# Altium project DuAn_HighVoltage_Switch_V3.PrjPcb
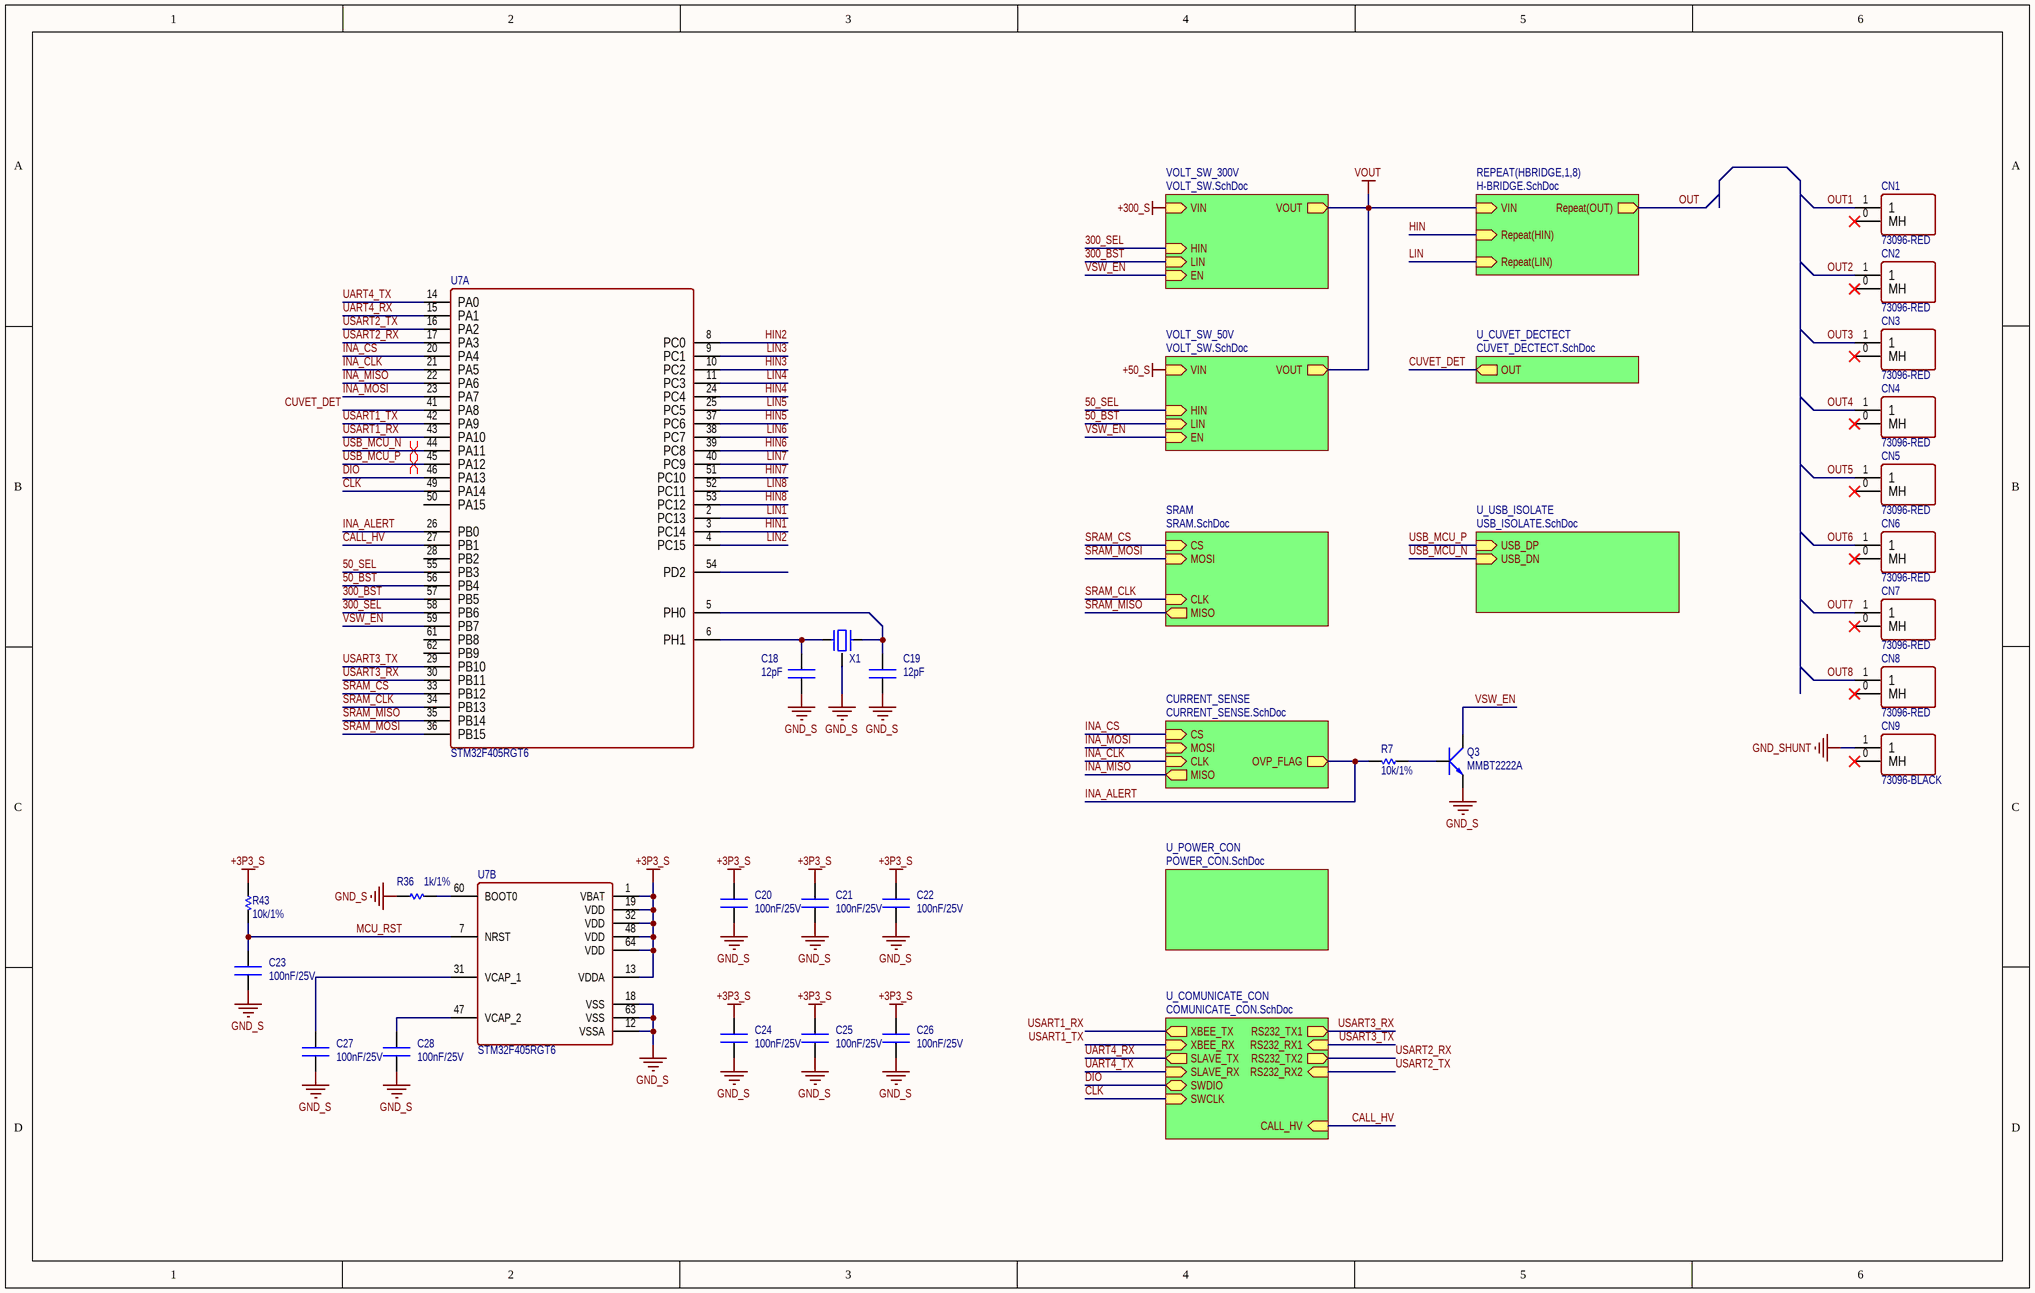
[diagram p0: MAIN.SchDoc]
10 sheets, 274 parts. Net scope: hierarchical (ports join the sheet entries above them; power ports are global).
Board file: PCB2.PcbDoc
Sheets:
  MAIN.SchDoc
    HBRIDGE1 = H-BRIDGE.SchDoc
    HBRIDGE2 = H-BRIDGE.SchDoc
    HBRIDGE3 = H-BRIDGE.SchDoc
    HBRIDGE4 = H-BRIDGE.SchDoc
    HBRIDGE5 = H-BRIDGE.SchDoc
    HBRIDGE6 = H-BRIDGE.SchDoc
    HBRIDGE7 = H-BRIDGE.SchDoc
    HBRIDGE8 = H-BRIDGE.SchDoc
    VOLT_SW_300V = VOLT_SW.SchDoc
    VOLT_SW_50V = VOLT_SW.SchDoc
    SRAM = SRAM.SchDoc
    CURRENT_SENSE = CURRENT_SENSE.SchDoc
    U_POWER_CON = POWER_CON.SchDoc
    U_COMUNICATE_CON = COMUNICATE_CON.SchDoc
    U_CUVET_DECTECT = CUVET_DECTECT.SchDoc
    U_USB_ISOLATE = USB_ISOLATE.SchDoc
  CUVET_DECTECT_POWER.SchDoc

## Sheet MAIN.SchDoc
size B; SheetNumber: 1; SheetTotal: 10

### Parts
C18  12pF  [CN-SMD-0603]
C19  12pF  [CN-SMD-0603]
C20  100nF/25V  [CN-SMD-0603]
C21  100nF/25V  [CN-SMD-0603]
C22  100nF/25V  [CN-SMD-0603]
C23  100nF/25V  [CN-SMD-0603]
C24  100nF/25V  [CN-SMD-0603]
C25  100nF/25V  [CN-SMD-0603]
C26  100nF/25V  [CN-SMD-0603]
C27  100nF/25V  [CN-SMD-0603]
C28  100nF/25V  [CN-SMD-0603]
CN1  73096-RED  [73096-2-RED]
CN2  73096-RED  [73096-2-RED]
CN3  73096-RED  [73096-2-RED]
CN4  73096-RED  [73096-2-RED]
CN5  73096-RED  [73096-2-RED]
CN6  73096-RED  [73096-2-RED]
CN7  73096-RED  [73096-2-RED]
CN8  73096-RED  [73096-2-RED]
CN9  73096-BLACK  [73096-0-BLACK]
Q3  MMBT2222A  [SOT23-132]
R7  10k/1%  [RES-SMD-0603]
R36  1k/1%  [RES-SMD-0603]
R43  10k/1%  [RES-SMD-0603]
U7  STM32F405RGT6  [LQFP64]  (parts A,B of 2)
X1  ECS-80-8-33Q-ADS  [XT4-16.000MHz-4_V]  (value not drawn)

### Sub-sheets
CURRENT_SENSE = CURRENT_SENSE.SchDoc: CS (in), MOSI (in), MISO (out), CLK (in), OVP_FLAG (out)
REPEAT(HBRIDGE,1,8) = H-BRIDGE.SchDoc: Repeat(OUT) (out), Repeat(HIN) (in), Repeat(LIN) (in), VIN (in)
SRAM = SRAM.SchDoc: CS (in), MOSI (in), MISO (out), CLK (in)
U_COMUNICATE_CON = COMUNICATE_CON.SchDoc: XBEE_TX (out), XBEE_RX (in), RS232_TX1 (out), RS232_RX1 (in), SLAVE_TX (out), SWDIO (bidir), SWCLK (in), RS232_TX2 (out), RS232_RX2 (in), SLAVE_RX (in), CALL_HV (in)
U_CUVET_DECTECT = CUVET_DECTECT.SchDoc: OUT (out)
U_POWER_CON = POWER_CON.SchDoc: no entries
U_USB_ISOLATE = USB_ISOLATE.SchDoc: USB_DP (in), USB_DN (in)
VOLT_SW_50V = VOLT_SW.SchDoc: HIN (in), LIN (in), EN (in), VOUT (out), VIN (in)
VOLT_SW_300V = VOLT_SW.SchDoc: HIN (in), LIN (in), EN (in), VOUT (out), VIN (in)

### Nets
+3P3_S: C20.1 C21.1 C22.1 C24.1 C25.1 C26.1 R43.2 U7.1(VBAT) U7.13(VDDA) U7.19(VDD) U7.32(VDD) U7.48(VDD) U7.64(VDD)
GND_S: C18.1 C19.1 C20.2 C21.2 C22.2 C23.2 C24.2 C25.2 C26.2 C27.2 C28.2 Q3.2(E) R36.2 U7.12(VSSA) U7.18(VSS) U7.63(VSS) X1.2,4(GND)
GND_SHUNT: CN9.1
VOUT: sheet REPEAT(HBRIDGE,1,8)/VIN, sheet VOLT_SW_300V/VOUT, sheet VOLT_SW_50V/VOUT
50_BST: U7.56(PB4) ; sheet VOLT_SW_50V/LIN
50_SEL: U7.55(PB3) ; sheet VOLT_SW_50V/HIN
300_BST: U7.57(PB5) ; sheet VOLT_SW_300V/LIN
300_SEL: U7.58(PB6) ; sheet VOLT_SW_300V/HIN
CALL_HV: U7.27(PB1) ; sheet U_COMUNICATE_CON/CALL_HV
CLK: U7.49(PA14) ; sheet U_COMUNICATE_CON/SWCLK
CUVET_DET: U7.41(PA8) ; sheet U_CUVET_DECTECT/OUT
DIO: U7.46(PA13) ; sheet U_COMUNICATE_CON/SWDIO
HIN: sheet REPEAT(HBRIDGE,1,8)/Repeat(HIN)
HIN1: U7.3(PC14)
HIN2: U7.8(PC0)
HIN3: U7.10(PC2)
HIN4: U7.24(PC4)
HIN5: U7.37(PC6)
HIN6: U7.39(PC8)
HIN7: U7.51(PC10)
HIN8: U7.53(PC12)
INA_ALERT: R7.1 U7.26(PB0) ; sheet CURRENT_SENSE/OVP_FLAG
INA_CLK: U7.21(PA5) ; sheet CURRENT_SENSE/CLK
INA_CS: U7.20(PA4) ; sheet CURRENT_SENSE/CS
INA_MISO: U7.22(PA6) ; sheet CURRENT_SENSE/MISO
INA_MOSI: U7.23(PA7) ; sheet CURRENT_SENSE/MOSI
LIN: sheet REPEAT(HBRIDGE,1,8)/Repeat(LIN)
LIN1: U7.2(PC13)
LIN2: U7.4(PC15)
LIN3: U7.9(PC1)
LIN4: U7.11(PC3)
LIN5: U7.25(PC5)
LIN6: U7.38(PC7)
LIN7: U7.40(PC9)
LIN8: U7.52(PC11)
MCU_RST: C23.1 R43.1 U7.7(NRST)
OUT: sheet REPEAT(HBRIDGE,1,8)/Repeat(OUT)
OUT1: CN1.1
OUT2: CN2.1
OUT3: CN3.1
OUT4: CN4.1
OUT5: CN5.1
OUT6: CN6.1
OUT7: CN7.1
OUT8: CN8.1
SRAM_CLK: U7.34(PB13) ; sheet SRAM/CLK
SRAM_CS: U7.33(PB12) ; sheet SRAM/CS
SRAM_MISO: U7.35(PB14) ; sheet SRAM/MISO
SRAM_MOSI: U7.36(PB15) ; sheet SRAM/MOSI
UART4_RX: U7.15(PA1) ; sheet U_COMUNICATE_CON/SLAVE_TX
UART4_TX: U7.14(PA0) ; sheet U_COMUNICATE_CON/SLAVE_RX
USART1_RX: U7.43(PA10) ; sheet U_COMUNICATE_CON/XBEE_TX
USART1_TX: U7.42(PA9) ; sheet U_COMUNICATE_CON/XBEE_RX
USART2_RX: U7.17(PA3) ; sheet U_COMUNICATE_CON/RS232_TX2
USART2_TX: U7.16(PA2) ; sheet U_COMUNICATE_CON/RS232_RX2
USART3_RX: U7.30(PB11) ; sheet U_COMUNICATE_CON/RS232_TX1
USART3_TX: U7.29(PB10) ; sheet U_COMUNICATE_CON/RS232_RX1
USB_MCU_N: U7.44(PA11) ; sheet U_USB_ISOLATE/USB_DN
USB_MCU_P: U7.45(PA12) ; sheet U_USB_ISOLATE/USB_DP
VSW_EN: Q3.3(C) U7.59(PB7) ; sheet VOLT_SW_300V/EN, sheet VOLT_SW_50V/EN
NetC18_2: C18.2 U7.6(PH1) X1.3
NetC19_2: C19.2 U7.5(PH0) X1.1
NetC27_1: C27.1 U7.31(VCAP_1)
NetC28_1: C28.1 U7.47(VCAP_2)
NetQ3_1: Q3.1(B) R7.2
NetR36_1: R36.1 U7.60(BOOT0)

Not connected (* = marked no-connect by the designer): CN1 0(MH)*; CN2 0(MH)*; CN3 0(MH)*; CN4 0(MH)*; CN5 0(MH)*; CN6 0(MH)*; CN7 0(MH)*; CN8 0(MH)*; CN9 0(MH)*; U7 28(PB2) 50(PA15) 54(PD2) 61(PB8) 62(PB9)

### Layout directives
differential pair; differential pair class USB: USB_MCU_N, USB_MCU_P

### Library data of the parts
C18 C19 = CN: CL10C120JB81PNC; PN: CL10C120JB81PNC
C20-C28 = CN: CL10B104KA8NNNC; PN: CL10B104KA8NNNC
CN1-CN8 = BANANA: Banana connector; PN: 73096-2-RED
CN9 = BANANA: Banana connector; PN: 73096-2-BLACK
Q3 = 2SC1815: PN: MMBT2222A
R7 R43 = Res-SMD: ERJ-3EKF1002V; Manufacturer: Generic Components; Class: Passive; PN: ERJ-3EKF1002V; Publisher: Altium Hobart Technology Centre
R36 = Res-SMD: ERJ-3EKF1001V; Manufacturer: Generic Components; Class: Passive; PN: ERJ-3EKF1001V; Publisher: Altium Hobart Technology Centre
U7 = STM32F405RGT6: High-performance foundation line, ARM Cortex-M4 core with DSP and FPU, 1 Mbyte Flash, 168 MHz CPU, ART Accelerator; PN: STM32F405RGT6
X1 = XT4: PN: ECS-80-8-33Q-ADS

## Sheet H-BRIDGE.SchDoc
size A; SheetNumber: 2; SheetTotal: 9
Used 8 times, as channels HBRIDGE1, HBRIDGE2, HBRIDGE3, HBRIDGE4, HBRIDGE5, HBRIDGE6, HBRIDGE7, HBRIDGE8. Parts and nets are listed once, with the designators drawn on the sheet.
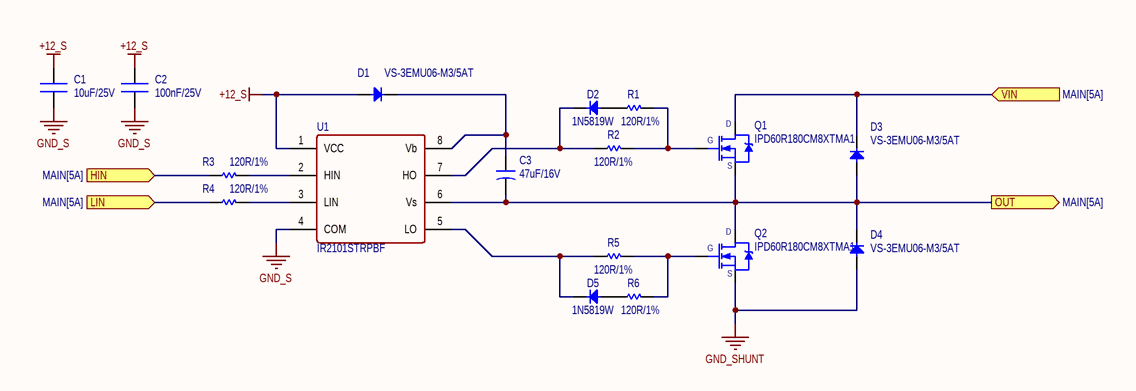
[diagram p1: H-BRIDGE.SchDoc]

### Parts
C1  10uF/25V  [CN-SMD-0603]
C2  100nF/25V  [CN-SMD-0603]
C3  47uF/16V  [Tantalum 1210]
D1  VS-3EMU06-M3/5AT  [DIO-SMD-A]
D2  1N5819W  [DIO-SMD-123]
D3  VS-3EMU06-M3/5AT  [DIO-SMD-A]
D4  VS-3EMU06-M3/5AT  [DIO-SMD-A]
D5  1N5819W  [DIO-SMD-123]
Q1  IPD60R180CM8XTMA1  [TO252-123]
Q2  IPD60R180CM8XTMA1  [TO252-123]
R1  120R/1%  [RES-SMD-0603]
R2  120R/1%  [RES-SMD-0603]
R3  120R/1%  [RES-SMD-0603]
R4  120R/1%  [RES-SMD-0603]
R5  120R/1%  [RES-SMD-0603]
R6  120R/1%  [RES-SMD-0603]
U1  IR2101STRPBF  [SO8]

### Ports
HIN (in, see MAIN[5A]), LIN (in, see MAIN[5A]), OUT (out, see MAIN[5A]), VIN (in, see MAIN[5A])

### Nets
+12_S: C1.2 C2.2 D1.1(A) U1.1(VCC)
GND_S: C1.1 C2.1 U1.4(COM)
GND_SHUNT: D4.1(A) Q2.3(S)
HIN: R3.1 ; port HIN
LIN: R4.1 ; port LIN
OUT: C3.2 D3.1(A) D4.2(K) Q1.3(S) Q2.2(D) U1.6(Vs) ; port OUT
VIN: D3.2(K) Q1.2(D) ; port VIN
NetC3_1: C3.1 D1.2(K) U1.8(Vb)
NetD2_1: D2.1(A) R1.1
NetD2_2: D2.2(K) R2.1 U1.7(HO)
NetD5_1: D5.1(A) R6.1
NetD5_2: D5.2(K) R5.1 U1.5(LO)
NetQ1_1: Q1.1(G) R1.2 R2.2
NetQ2_1: Q2.1(G) R5.2 R6.2
NetR3_2: R3.2 U1.2(HIN)
NetR4_2: R4.2 U1.3(LIN)

### Channels
HBRIDGE1: designators end in A; ports HIN=HIN1 LIN=LIN1 OUT=OUT1 VIN=VOUT
HBRIDGE2: designators end in B; ports HIN=HIN2 LIN=LIN2 OUT=OUT2 VIN=VOUT
HBRIDGE3: designators end in C; ports HIN=HIN3 LIN=LIN3 OUT=OUT3 VIN=VOUT
HBRIDGE4: designators end in D; ports HIN=HIN4 LIN=LIN4 OUT=OUT4 VIN=VOUT
HBRIDGE5: designators end in E; ports HIN=HIN5 LIN=LIN5 OUT=OUT5 VIN=VOUT
HBRIDGE6: designators end in F; ports HIN=HIN6 LIN=LIN6 OUT=OUT6 VIN=VOUT
HBRIDGE7: designators end in G; ports HIN=HIN7 LIN=LIN7 OUT=OUT7 VIN=VOUT
HBRIDGE8: designators end in H; ports HIN=HIN8 LIN=LIN8 OUT=OUT8 VIN=VOUT

### Library data of the parts
C1 = CN: 0603W106M250XD; PN: 0603W106M250XD
C2 = CN: CL10B104KA8NNNC; PN: CL10B104KA8NNNC
C3 = CN-SMD: TCNT476M016R0200; PN: TCNT476M016R0200; LatestRevisionDate: 17-Jul-2002; LatestRevisionNote: Re-released for DXP Platform.; PackageReference: POLAR0.8; Publisher: Altium Limited
D1-D5 = Diode SMD: Code - JEDEC: DO-214-AB; Published: 8-Jun-2000; Revision: July-2002: Re-released for DXP Platform.; Publisher: Altium Limited
  D1 D3 D4: PN: VS-3EMU06-M3/5AT
  D2 D5: PN: 1N5819W
Q1 Q2 = FDD8870: PN: IPD60R180CM8XTMA1
R1-R6 = Res-SMD: ERJ-3EKF1200V; Manufacturer: Generic Components; Class: Passive; PN: ERJ-3EKF1200V; Publisher: Altium Hobart Technology Centre
U1 = IR2101S: PN: IR2101STRPBF

## Sheet VOLT_SW.SchDoc
size B; SheetNumber: 5; SheetTotal: 9
Used 2 times, as channels VOLT_SW_300V, VOLT_SW_50V. Parts and nets are listed once, with the designators drawn on the sheet.
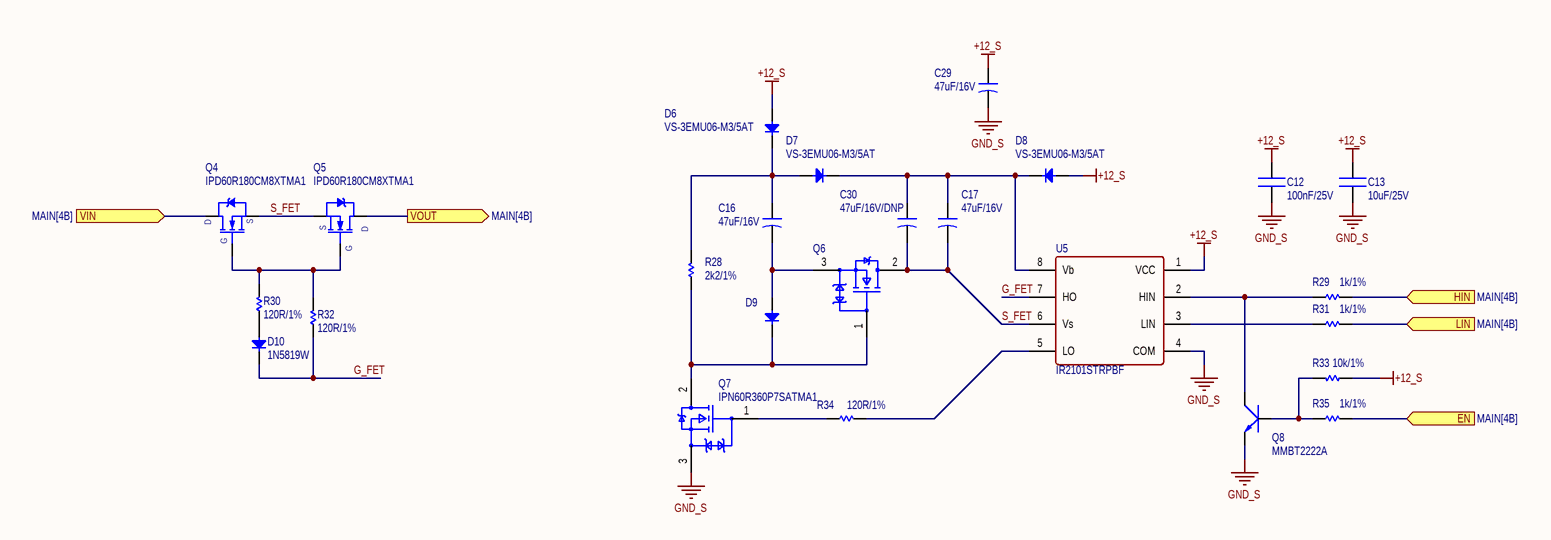
[diagram p2: VOLT_SW.SchDoc]

### Parts
C12  100nF/25V  [CN-SMD-0603]
C13  10uF/25V  [CN-SMD-0603]
C16  47uF/16V  [Tantalum 1210]
C17  47uF/16V  [Tantalum 1210]
C29  47uF/16V  [Tantalum 1210]
C30  47uF/16V/DNP  [Tantalum 1210]
D6  VS-3EMU06-M3/5AT  [DIO-SMD-A]
D7  VS-3EMU06-M3/5AT  [DIO-SMD-A]
D8  VS-3EMU06-M3/5AT  [DIO-SMD-A]
D9  VS-3EMU06-M3/5AT  [DIO-SMD-A]  (value not drawn)
D10  1N5819W  [DIO-SMD-123]
Q4  IPD60R180CM8XTMA1  [TO252-123]
Q5  IPD60R180CM8XTMA1  [TO252-123]
Q6  IPN60R360P7SATMA1  [SOT223-3]  (value not drawn)
Q7  IPN60R360P7SATMA1  [SOT223-3]
Q8  MMBT2222A  [SOT23-132]
R28  2k2/1%  [RES-SMD-0603]
R29  1k/1%  [RES-SMD-0603]
R30  120R/1%  [RES-SMD-0603]
R31  1k/1%  [RES-SMD-0603]
R32  120R/1%  [RES-SMD-0603]
R33  10k/1%  [RES-SMD-0603]
R34  120R/1%  [RES-SMD-0603]
R35  1k/1%  [RES-SMD-0603]
U5  IR2101STRPBF  [SO8]

### Ports
EN (in, see MAIN[4B]), HIN (in, see MAIN[4B]), LIN (in, see MAIN[4B]), VIN (in, see MAIN[4B]), VOUT (out, see MAIN[4B])

### Nets
+12_S: C12.2 C13.2 C29.1 D6.1(A) D8.1(A) R33.1 U5.1(VCC)
GND_S: C12.1 C13.1 C29.2 Q7.3(Source) Q8.2(E) U5.4(COM)
EN: R35.1 ; port EN
G_FET: D10.2(K) R32.1 U5.7(HO)
HIN: R29.1 ; port HIN
LIN: R31.1 ; port LIN
S_FET: C17.2 C30.2 Q4.3(S) Q5.3(S) Q6.2(Drain) U5.6(Vs)
VIN: Q4.2(D) ; port VIN
VOUT: Q5.2(D) ; port VOUT
NetC16_1: C16.1 D6.2(K) D7.1(A) R28.2
NetC16_2: C16.2 D9.1(A) Q6.3(Source)
NetC17_1: C17.1 C30.1 D7.2(K) D8.2(K) U5.8(Vb)
NetD9_2: D9.2(K) Q6.1(Gate) Q7.2(Drain) R28.1
NetD10_1: D10.1(A) R30.1
NetQ4_1: Q4.1(G) Q5.1(G) R30.2 R32.2
NetQ7_1: Q7.1(Gate) R34.1
NetQ8_1: Q8.1(B) R33.2 R35.2
NetQ8_3: Q8.3(C) R29.2 U5.2(HIN)
NetR31_2: R31.2 U5.3(LIN)
NetR34_2: R34.2 U5.5(LO)

### Channels
VOLT_SW_300V: designators end in A; ports EN=VSW_EN HIN=300_SEL LIN=300_BST VIN=+300_S VOUT=VOUT
VOLT_SW_50V: designators end in B; ports EN=VSW_EN HIN=50_SEL LIN=50_BST VIN=+50_S VOUT=VOUT

### Library data of the parts
C12 = CN: CL10B104KA8NNNC; PN: CL10B104KA8NNNC
C13 = CN: 0603W106M250XD; PN: 0603W106M250XD
C16 C17 C29 = CN-SMD: TCNT476M016R0200; PN: TCNT476M016R0200; LatestRevisionDate: 17-Jul-2002; LatestRevisionNote: Re-released for DXP Platform.; PackageReference: POLAR0.8; Publisher: Altium Limited
C30 = CN-SMD: TCNT476M016R0200/DNP; PN: TCNT476M016R0200/DNP; LatestRevisionDate: 17-Jul-2002; LatestRevisionNote: Re-released for DXP Platform.; PackageReference: POLAR0.8; Publisher: Altium Limited
D6-D10 = Diode SMD: Code - JEDEC: DO-214-AB; Published: 8-Jun-2000; Revision: July-2002: Re-released for DXP Platform.; Publisher: Altium Limited
  D6-D9: PN: VS-3EMU06-M3/5AT
  D10: PN: 1N5819W
Q4 Q5 = FDD8870: PN: IPD60R180CM8XTMA1
Q6 Q7 = IPN60R360P7SATMA1: Manufacturer: Infineon; Max Junction Temp: +150°C; Number Of Channels: 1; Pulse Drain Current: 26A; Drain To Source Breakdown Voltage: 600V; Gate To Source Voltage: 20V; Depletion Mode: False; Typ Forward Diode Voltage: 0.9V; Gate Charge At Vgs: 13nC @ 10V; Turn Off Delay Time: 42ns; Input Capacitace At Vds: 555pF @ 400V; Power Dissipation: 7W; Drain To Source Resistance: 0.3Ω; Threshold Vgs Max: 4V; Drain To Source Voltage: 650V; Reverse Recovery Time: 145ns; Continuous Drain Current: 9A; Reverse Recovery Charge: 740nC; Rthja Max: 35°C/W; Turn On Delay Time: 8ns; Threshold Vgs Min: 3V; Device Class L3: MOSFETs; Device Class L2: Transistors; Manufacturer Part Number: IPN60R360P7SATMA1; PN: IPN60R360P7SATMA1; Footprint Url: https://www.infineon.com/cms/en/product/packages/PG-SOT223/PG-SOT223-3-1/; Category: Trans; Device Class L1: Discrete Semiconductors; Lead Free: Yes; ComponentLink2URL: https://www.infineon.com/dgdl/Infineon-IPN60R360P7S-DS-v02_00-EN.pdf?fileId=5546d4625cc9456a015cf3d550b26150; Temperature: -40°C to +150°C; Temperature Range High: +150°C; Temperature Range Low: -40°C; Automotive: No; ComponentLink2Description: Datasheet; Digikey Description: MOSFET N-CHANNEL 600V 9A SOT223; RoHS: TRUE; Package: PG-SOT223-3; Height: 1.8mm; Octopart: https://octopart.com/ipn60r360p7satma1-infineon-84309560
Q8 = 2SC1815: PN: MMBT2222A
R28 = Res-SMD: ERJ-3EKF2201V; Manufacturer: Generic Components; Class: Passive; PN: ERJ-3EKF2201V; Publisher: Altium Hobart Technology Centre
R29 R31 R35 = Res-SMD: as R36 on sheet MAIN; PN: ERJ-3EKF1001V; Publisher: Altium Hobart Technology Centre
R30 R32 R34 = Res-SMD: as R1 on sheet H-BRIDGE; PN: ERJ-3EKF1200V; Publisher: Altium Hobart Technology Centre
R33 = Res-SMD: as R7 on sheet MAIN; PN: ERJ-3EKF1002V; Publisher: Altium Hobart Technology Centre
U5 = IR2101S

## Sheet SRAM.SchDoc
size A; SheetNumber: 4; SheetTotal: 10
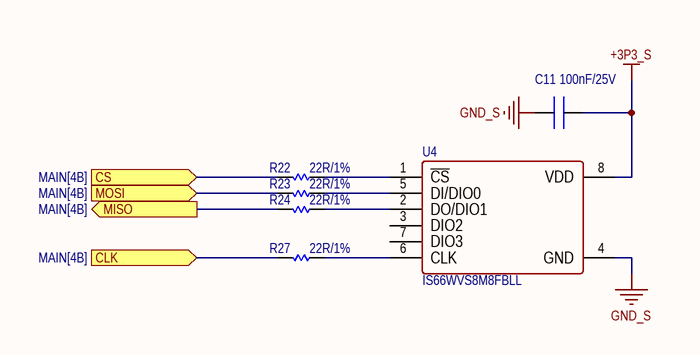
[diagram p3: SRAM.SchDoc]

### Parts
C11  100nF/25V  [CN-SMD-0603]
R22  22R/1%  [RES-SMD-0603]
R23  22R/1%  [RES-SMD-0603]
R24  22R/1%  [RES-SMD-0603]
R27  22R/1%  [RES-SMD-0603]
U4  IS66WVS8M8FBLL  [SO8]

### Ports
CLK (in, see MAIN[4B]), CS (in, see MAIN[4B]), MISO (out, see MAIN[4B]), MOSI (in, see MAIN[4B])

### Nets
+3P3_S: C11.2 U4.8(VDD)
GND_S: C11.1 U4.4(GND)
SRAM_CLK: R27.2 ; port CLK
SRAM_CS: R22.2 ; port CS
SRAM_MISO: R24.2 ; port MISO
SRAM_MOSI: R23.2 ; port MOSI
NetR22_1: R22.1 U4.1(~{CS})
NetR23_1: R23.1 U4.5(DI/DIO0)
NetR24_1: R24.1 U4.2(DO/DIO1)
NetR27_1: R27.1 U4.6(CLK)

Not connected (* = marked no-connect by the designer): U4 3(DIO2) 7(DIO3)

### Library data of the parts
C11 = CN: CL10B104KA8NNNC; PN: CL10B104KA8NNNC
R22-R24 R27 = Res-SMD: ERJ-3EKF22R0V; Manufacturer: Generic Components; Class: Passive; PN: ERJ-3EKF22R0V; Publisher: Altium Hobart Technology Centre
U4 = IS66WVS8M8FBLL: 64Mb SerialRAM 1.8V/3.0V, 104MHZ, SPI & QPI PROTOCOL; PN: IS66WVS8M8FBLL

## Sheet CURRENT_SENSE.SchDoc
size A; SheetNumber: 3; SheetTotal: 9
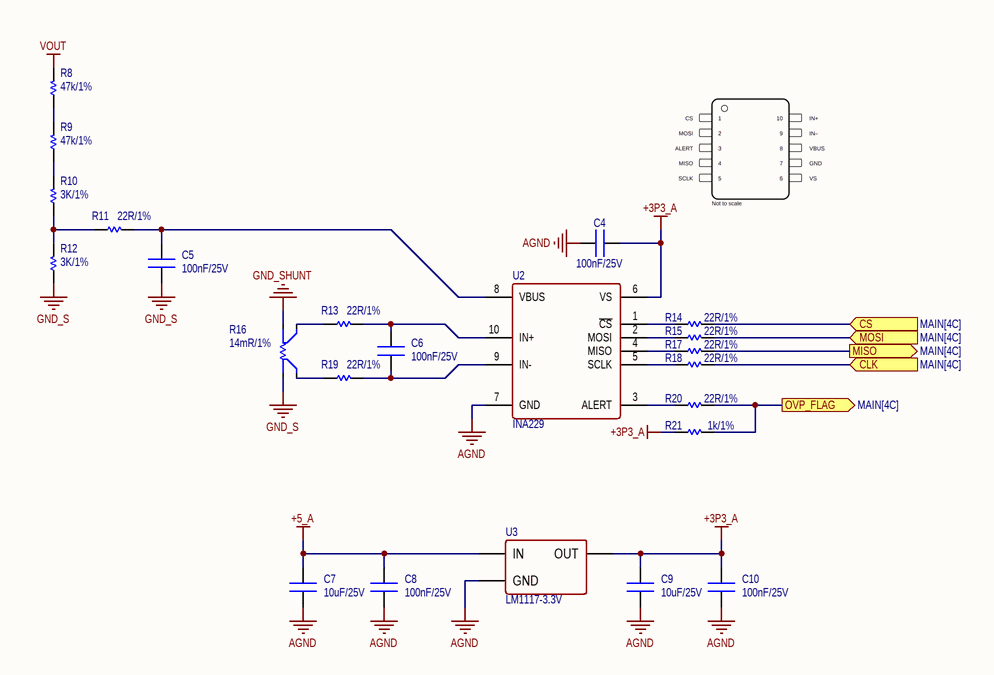
[diagram p4: CURRENT_SENSE.SchDoc]

### Parts
C4  100nF/25V  [CN-SMD-0603]
C5  100nF/25V  [CN-SMD-0603]
C6  100nF/25V  [CN-SMD-0603]
C7  10uF/25V  [CN-SMD-0603]
C8  100nF/25V  [CN-SMD-0603]
C9  10uF/25V  [CN-SMD-0603]
C10  100nF/25V  [CN-SMD-0603]
R8  47k/1%  [RES-SMD-0603]
R9  47k/1%  [RES-SMD-0603]
R10  3K/1%  [RES-SMD-0603]
R11  22R/1%  [RES-SMD-0603]
R12  3K/1%  [RES-SMD-0603]
R13  22R/1%  [RES-SMD-0603]
R14  22R/1%  [RES-SMD-0603]
R15  22R/1%  [RES-SMD-0603]
R16  14mR/1%  [RES-SMD-2010-SHUNT]
R17  22R/1%  [RES-SMD-0603]
R18  22R/1%  [RES-SMD-0603]
R19  22R/1%  [RES-SMD-0603]
R20  22R/1%  [RES-SMD-0603]
R21  1k/1%  [RES-SMD-0603]
U2  INA229  [VSSOP10]
U3  LM1117-3.3V  [SOT223]

### Ports
CLK (in, see MAIN[4C]), CS (in, see MAIN[4C]), MISO (out, see MAIN[4C]), MOSI (in, see MAIN[4C]), OVP_FLAG (out, see MAIN[4C])

### Nets
+3P3_A: C4.2 C9.2 C10.2 R21.2 U2.6(VS) U3.2,4(OUT)
+5_A: C7.2 C8.2 U3.3(IN)
AGND: C4.1 C7.1 C8.1 C9.1 C10.1 U2.7(GND) U3.1(GND)
GND_S: C5.1 R12.1 R16.2
GND_SHUNT: R16.1
VOUT: R8.2
INA_ALERT: R20.2 R21.1 ; port OVP_FLAG
INA_CLK: R18.2 ; port CLK
INA_CS: R14.2 ; port CS
INA_MISO: R17.2 ; port MISO
INA_MOSI: R15.2 ; port MOSI
NetC5_2: C5.2 R11.2 U2.8(VBUS)
NetC6_1: C6.1 R19.2 U2.9(IN-)
NetC6_2: C6.2 R13.2 U2.10(IN+)
NetR8_1: R8.1 R9.2
NetR9_1: R9.1 R10.2
NetR10_1: R10.1 R11.1 R12.2
NetR13_1: R13.1 R16.3(V)
NetR14_1: R14.1 U2.1(~{CS})
NetR15_1: R15.1 U2.2(MOSI)
NetR16_4: R16.4(V) R19.1
NetR17_1: R17.1 U2.4(MISO)
NetR18_1: R18.1 U2.5(SCLK)
NetR20_1: R20.1 U2.3(ALERT)

### Library data of the parts
C4-C6 C8 C10 = CN: CL10B104KA8NNNC; PN: CL10B104KA8NNNC
C7 C9 = CN: 0603W106M250XD; PN: 0603W106M250XD
R8 R9 = Res-SMD: ERJ-3EKF4702V; Manufacturer: Generic Components; Class: Passive; PN: ERJ-3EKF4702V; Publisher: Altium Hobart Technology Centre
R10 R12 = Res-SMD: ERA-3AEB302V; Manufacturer: Generic Components; Class: Passive; PN: ERA-3AEB302V; Publisher: Altium Hobart Technology Centre
R11 R13-R15 R17-R20 = Res-SMD: as R22 on sheet SRAM; PN: ERJ-3EKF22R0V; Publisher: Altium Hobart Technology Centre
R16 = Res-SMD-SHUNT: MSMA2010R0140FDM; Manufacturer: Generic Components; Class: Passive; PN: MSMA2010R0140FDM; Publisher: Altium Hobart Technology Centre
R21 = Res-SMD: as R36 on sheet MAIN; PN: ERJ-3EKF1001V; Publisher: Altium Hobart Technology Centre
U2 = INA229: INA229 85-V, 20-Bit, Ultra-Precise Power/Energy/Charge Monitor With SPI Interface; PN: INA229AIDGSR
U3 = LM1117: TLV1117-33IDCYR; PN: TLV1117-33IDCYR; Website: http://group3i.net

## Sheet POWER_CON.SchDoc
size A; SheetNumber: 7; SheetTotal: 9
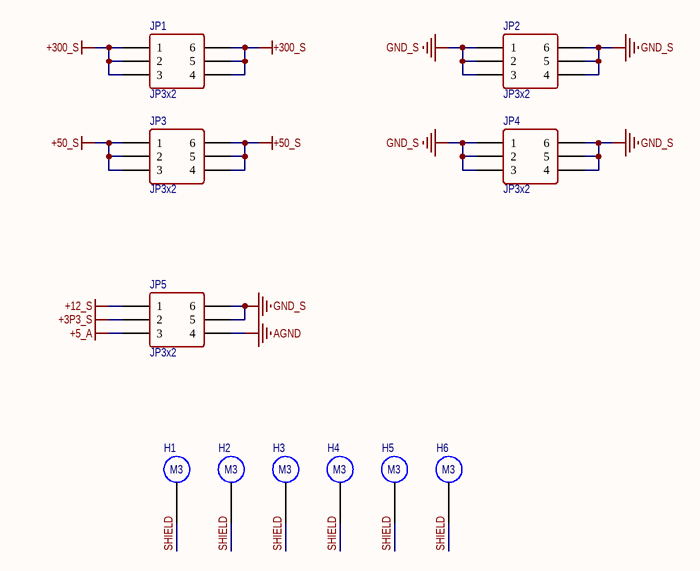
[diagram p5: POWER_CON.SchDoc]

### Parts
H1  M3  [M3]  (no BOM)
H2  M3  [M3]  (no BOM)
H3  M3  [M3]  (no BOM)
H4  M3  [M3]  (no BOM)
H5  M3  [M3]  (no BOM)
H6  M3  [M3]  (no BOM)
JP1  JP3x2  [JP3-C2T]
JP2  JP3x2  [JP3-C2T]
JP3  JP3x2  [JP3-C2T]
JP4  JP3x2  [JP3-C2T]
JP5  JP3x2  [JP3-C2T]

### Nets
+3P3_S: JP5.2
+5_A: JP5.3
+12_S: JP5.1
+50_S: JP3.1 JP3.2 JP3.3 JP3.4 JP3.5 JP3.6
+300_S: JP1.1 JP1.2 JP1.3 JP1.4 JP1.5 JP1.6
AGND: JP5.4
GND_S: JP2.1 JP2.2 JP2.3 JP2.4 JP2.5 JP2.6 JP4.1 JP4.2 JP4.3 JP4.4 JP4.5 JP4.6 JP5.5 JP5.6
SHIELD: H1.1 H2.1 H3.1 H4.1 H5.1 H6.1

### Library data of the parts
JP1-JP5 = JP3x2: 5-534206-3; Manufacturer: W¨¹rth Elektronik eiSos GmbH; partNo: 61300621821; ComponentLink1 Description: Manufacturer; ComponentLink2 Description: Datasheet; NoPins: 06; Created Date: 29 March 2013; ComponentLink1URL: http://www.we-online.com; ComponentLink2URL: http://katalog.we-online.de/em/datasheet/6130xx21821.pdf; Created by: Karrer Zheng

## Sheet COMUNICATE_CON.SchDoc
size A; SheetNumber: 8; SheetTotal: 10
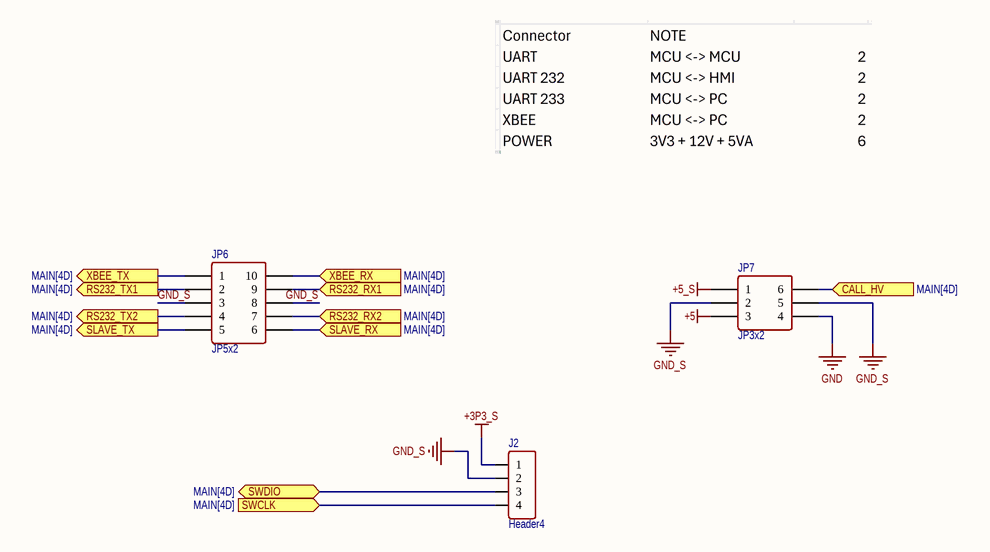
[diagram p6: COMUNICATE_CON.SchDoc]

### Parts
J2  Header4  [XH2.54-4-DIP]
JP6  JP5x2  [JP5-D2T]
JP7  JP3x2  [JP3-C2T]

### Ports
CALL_HV (in, see MAIN[4D]), RS232_RX1 (in, see MAIN[4D]), RS232_RX2 (in, see MAIN[4D]), RS232_TX1 (out, see MAIN[4D]), RS232_TX2 (out, see MAIN[4D]), SLAVE_RX (in, see MAIN[4D]), SLAVE_TX (out, see MAIN[4D]), SWCLK (in, see MAIN[4D]), SWDIO (bidir, see MAIN[4D]), XBEE_RX (in, see MAIN[4D]), XBEE_TX (out, see MAIN[4D])

### Nets
+3P3_S: J2.1
+5: JP7.3
+5_S: JP7.1
GND: JP7.4
GND_S: J2.2 JP6.3 JP6.8 JP7.2 JP7.5
CALL_HV: JP7.6 ; port CALL_HV
CLK: J2.4 ; port SWCLK
DIO: J2.3 ; port SWDIO
UART4_RX: JP6.5 ; port SLAVE_TX
UART4_TX: JP6.6 ; port SLAVE_RX
USART1_RX: JP6.1 ; port XBEE_TX
USART1_TX: JP6.10 ; port XBEE_RX
USART2_RX: JP6.4 ; port RS232_TX2
USART2_TX: JP6.7 ; port RS232_RX2
USART3_RX: JP6.2 ; port RS232_TX1
USART3_TX: JP6.9 ; port RS232_RX1

### Library data of the parts
J2 = Header4: Connector 4; Manufacturer: W¨¹rth Elektronik eiSos GmbH; partNo: 613002143121; ComponentLink1 Description: Manufacturer; ComponentLink2 Description: Datasheet; NoPins: 02; Created Date: 29 March 2013; ComponentLink1URL: http://www.we-online.com; ComponentLink2URL: http://katalog.we-online.de/em/datasheet/6130xx143121.pdf; Created by: Karrer Zheng
JP6 = JP5x2: WR-PHD 2.54 mm Dual Socket Header; Manufacturer: W¨¹rth Elektronik eiSos GmbH; partNo: 61301021821; ComponentLink1 Description: Manufacturer; ComponentLink2 Description: Datasheet; NoPins: 10; Created Date: 29 March 2013; ComponentLink1URL: http://www.we-online.com; ComponentLink2URL: http://katalog.we-online.de/em/datasheet/6130xx21821.pdf; Created by: Karrer Zheng
JP7 = JP3x2: as JP1 on sheet POWER_CON; Created Date: 29 March 2013; ComponentLink1URL: http://www.we-online.com; ComponentLink2URL: http://katalog.we-online.de/em/datasheet/6130xx21821.pdf; Created by: Karrer Zheng

## Sheet CUVET_DECTECT.SchDoc
size A; SheetNumber: 6; SheetTotal: 10
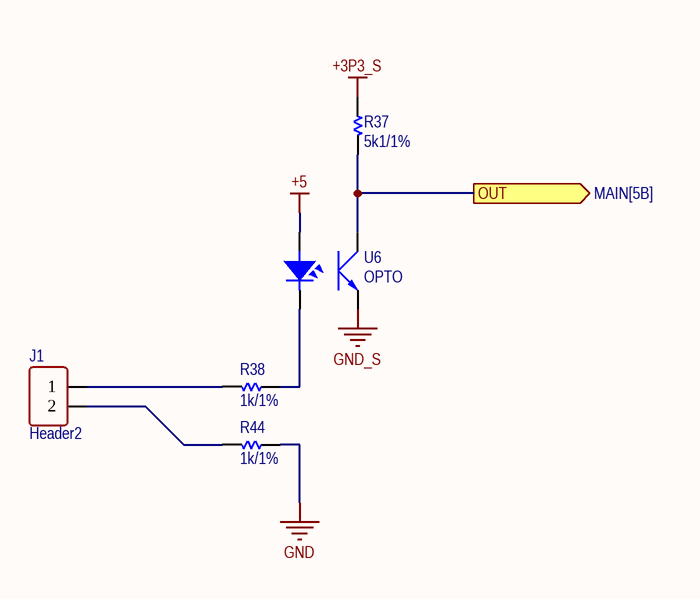
[diagram p7: CUVET_DECTECT.SchDoc]

### Parts
J1  Header2  [XH2.54-2-DIP]
R37  5k1/1%  [RES-SMD-0603]
R38  1k/1%  [RES-SMD-0603]
R44  1k/1%  [RES-SMD-0603]
U6  OPTO  [EL3H7]

### Ports
OUT (out, see MAIN[5B])

### Nets
+3P3_S: R37.1
+5: U6.A
GND: R44.2
GND_S: U6.E
CUVET_DET: R37.2 U6.C ; port OUT
NetJ1_1: J1.1 R38.1
NetJ1_2: J1.2 R44.1
NetR38_2: R38.2 U6.K

### Library data of the parts
J1 = Header2: Connector 2; Manufacturer: W¨¹rth Elektronik eiSos GmbH; partNo: 613002143121; ComponentLink1 Description: Manufacturer; ComponentLink2 Description: Datasheet; NoPins: 02; Created Date: 29 March 2013; ComponentLink1URL: http://www.we-online.com; ComponentLink2URL: http://katalog.we-online.de/em/datasheet/6130xx143121.pdf; Created by: Karrer Zheng
R37 = Res-SMD: ERJ-3EKF5101V; Manufacturer: Generic Components; Class: Passive; PN: ERJ-3EKF5101V; Publisher: Altium Hobart Technology Centre
R38 R44 = Res-SMD: as R36 on sheet MAIN; PN: ERJ-3EKF1001V; Publisher: Altium Hobart Technology Centre
U6 = OPTO: EL3H7(B)(TA)-VG; PN: EL3H7(B)(TA)-VG

## Sheet USB_ISOLATE.SchDoc
size A; SheetNumber: 9; SheetTotal: 10
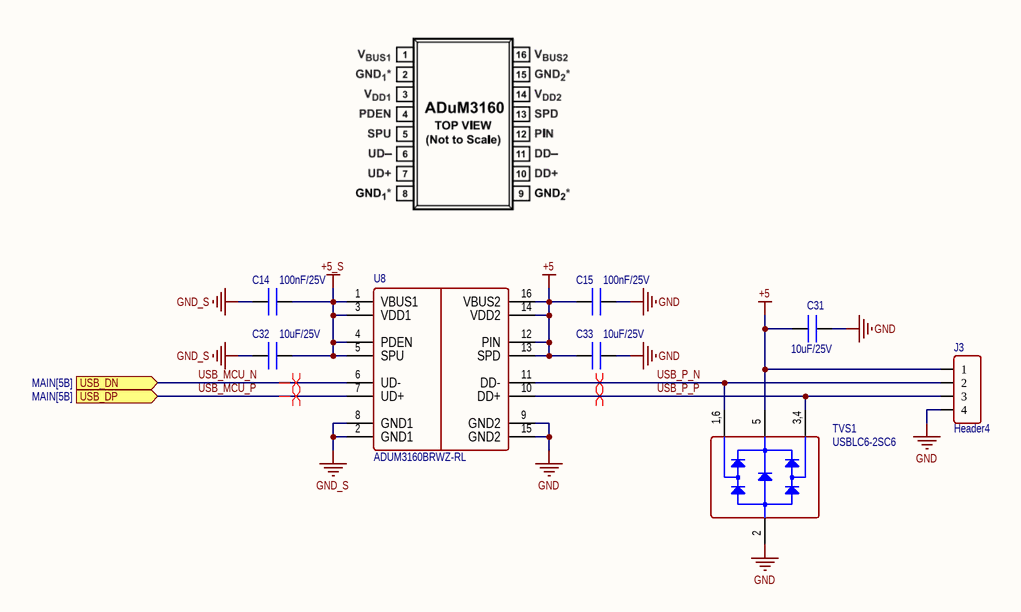
[diagram p8: USB_ISOLATE.SchDoc]

### Parts
C14  100nF/25V  [CN-SMD-0603]
C15  100nF/25V  [CN-SMD-0603]
C31  10uF/25V  [CN-SMD-0603]
C32  10uF/25V  [CN-SMD-0603]
C33  10uF/25V  [CN-SMD-0603]
J3  Header4  [XH2.54-4-DIP]
TVS1  USBLC6-2SC6  [SOT23-6]
U8  ADUM3160BRWZ-RL  [SO16L]

### Ports
USB_DN (in, see MAIN[5B]), USB_DP (in, see MAIN[5B])

### Nets
+5: C15.2 C31.2 C33.2 J3.1 TVS1.5 U8.12(PIN) U8.13(SPD) U8.14(VDD2) U8.16(VBUS2)
+5_S: C14.1 C32.1 U8.1(VBUS1) U8.3(VDD1) U8.4(PDEN) U8.5(SPU)
GND: C15.1 C31.1 C33.1 J3.4 TVS1.2 U8.9(GND2) U8.15(GND2)
GND_S: C14.2 C32.2 U8.2(GND1) U8.8(GND1)
USB_MCU_N: U8.6(UD-) ; port USB_DN
USB_MCU_P: U8.7(UD+) ; port USB_DP
USB_P_N: J3.2 TVS1.1,6(IO1) U8.11(DD-)
USB_P_P: J3.3 TVS1.3,4(IO2) U8.10(DD+)

### Layout directives
differential pair; differential pair class USB: USB_P_N, USB_P_P
differential pair: USB_MCU_N, USB_MCU_P

### Library data of the parts
C14 C15 = CN: CL10B104KA8NNNC; PN: CL10B104KA8NNNC
C31-C33 = CN: 0603W106M250XD; PN: 0603W106M250XD
J3 = Header4: as J2 on sheet COMUNICATE_CON; Created Date: 29 March 2013; ComponentLink1URL: http://www.we-online.com; ComponentLink2URL: http://katalog.we-online.de/em/datasheet/6130xx143121.pdf; Created by: Karrer Zheng
TVS1 = USBLC6-2: PN: USBLC6-2SC6
U8 = ADUM3160: Full/Low Speed 2.5 kV USB Digital Isolator; PN: ADUM3160BRWZ-RL

## Sheet CUVET_DECTECT_POWER.SchDoc
size A; SheetNumber: 9; SheetTotal: 9
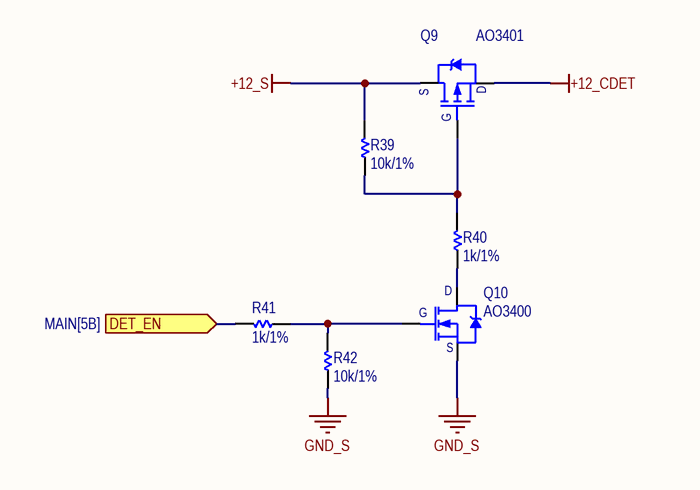
[diagram p9: CUVET_DECTECT_POWER.SchDoc]

### Parts
Q9  AO3401  [SOT23-123]
Q10  AO3400  [SOT23-123]
R39  10k/1%  [RES-SMD-0603]
R40  1k/1%  [RES-SMD-0603]
R41  1k/1%  [RES-SMD-0603]
R42  10k/1%  [RES-SMD-0603]

### Ports
DET_EN (in, see MAIN[5B])

### Nets
+12_CDET: Q9.2(D)
+12_S: Q9.3(S) R39.1
GND_S: Q10.3(S) R42.2
NetQ9_1: Q9.1(G) R39.2 R40.1
NetQ10_1: Q10.1(G) R41.2 R42.1
NetQ10_2: Q10.2(D) R40.2
NetR41_1: R41.1 ; port DET_EN

### Library data of the parts
Q9 = AO3401: P-MOS 30V 4A
Q10 = AO3400: N-MOS 30V 5.8A
R39 R42 = Res-SMD: as R7 on sheet MAIN; PN: ERJ-3EKF1002V; Publisher: Altium Hobart Technology Centre
R40 R41 = Res-SMD: as R36 on sheet MAIN; PN: ERJ-3EKF1001V; Publisher: Altium Hobart Technology Centre

## Nets that join several sheets
+3P3_S: MAIN (13 pins), SRAM (C11.2 U4.8), POWER_CON (JP5.2), COMUNICATE_CON (J2.1), CUVET_DECTECT (R37.1)
+5: COMUNICATE_CON (JP7.3), CUVET_DECTECT (U6.A), USB_ISOLATE (9 pins)
+5_A: CURRENT_SENSE (C7.2 C8.2 U3.3), POWER_CON (JP5.3)
+5_S: COMUNICATE_CON (JP7.1), USB_ISOLATE (6 pins)
+12_S: HBRIDGE1 (C1A.2 C2A.2 D1A.1 U1A.1), HBRIDGE2 (C1B.2 C2B.2 D1B.1 U1B.1), HBRIDGE3 (C1C.2 C2C.2 D1C.1 U1C.1), HBRIDGE4 (C1D.2 C2D.2 D1D.1 U1D.1), HBRIDGE5 (C1E.2 C2E.2 D1E.1 U1E.1), HBRIDGE6 (C1F.2 C2F.2 D1F.1 U1F.1), HBRIDGE7 (C1G.2 C2G.2 D1G.1 U1G.1), HBRIDGE8 (C1H.2 C2H.2 D1H.1 U1H.1), VOLT_SW_300V (7 pins), VOLT_SW_50V (7 pins), POWER_CON (JP5.1), CUVET_DECTECT_POWER (Q9.3 R39.1)
+50_S: VOLT_SW_50V (Q4B.2), POWER_CON (6 pins)
+300_S: VOLT_SW_300V (Q4A.2), POWER_CON (6 pins)
AGND: CURRENT_SENSE (7 pins), POWER_CON (JP5.4)
GND: COMUNICATE_CON (JP7.4), CUVET_DECTECT (R44.2), USB_ISOLATE (7 pins)
GND_S: MAIN (17 pins), HBRIDGE1 (C1A.1 C2A.1 U1A.4), HBRIDGE2 (C1B.1 C2B.1 U1B.4), HBRIDGE3 (C1C.1 C2C.1 U1C.4), HBRIDGE4 (C1D.1 C2D.1 U1D.4), HBRIDGE5 (C1E.1 C2E.1 U1E.4), HBRIDGE6 (C1F.1 C2F.1 U1F.4), HBRIDGE7 (C1G.1 C2G.1 U1G.4), HBRIDGE8 (C1H.1 C2H.1 U1H.4), VOLT_SW_300V (6 pins), VOLT_SW_50V (6 pins), SRAM (C11.1 U4.4), CURRENT_SENSE (C5.1 R12.1 R16.2), POWER_CON (14 pins), COMUNICATE_CON (5 pins), CUVET_DECTECT (U6.E), USB_ISOLATE (C14.2 C32.2 U8.2 U8.8), CUVET_DECTECT_POWER (Q10.3 R42.2)
GND_SHUNT: MAIN (CN9.1), HBRIDGE1 (D4A.1 Q2A.3), HBRIDGE2 (D4B.1 Q2B.3), HBRIDGE3 (D4C.1 Q2C.3), HBRIDGE4 (D4D.1 Q2D.3), HBRIDGE5 (D4E.1 Q2E.3), HBRIDGE6 (D4F.1 Q2F.3), HBRIDGE7 (D4G.1 Q2G.3), HBRIDGE8 (D4H.1 Q2H.3), CURRENT_SENSE (R16.1)
VOUT: HBRIDGE1 (D3A.2 Q1A.2), HBRIDGE2 (D3B.2 Q1B.2), HBRIDGE3 (D3C.2 Q1C.2), HBRIDGE4 (D3D.2 Q1D.2), HBRIDGE5 (D3E.2 Q1E.2), HBRIDGE6 (D3F.2 Q1F.2), HBRIDGE7 (D3G.2 Q1G.2), HBRIDGE8 (D3H.2 Q1H.2), VOLT_SW_300V (Q5A.2), VOLT_SW_50V (Q5B.2), CURRENT_SENSE (R8.2)
50_BST: MAIN (U7.56), VOLT_SW_50V (R31B.1)
50_SEL: MAIN (U7.55), VOLT_SW_50V (R29B.1)
300_BST: MAIN (U7.57), VOLT_SW_300V (R31A.1)
300_SEL: MAIN (U7.58), VOLT_SW_300V (R29A.1)
CALL_HV: MAIN (U7.27), COMUNICATE_CON (JP7.6)
CLK: MAIN (U7.49), COMUNICATE_CON (J2.4)
CUVET_DET: MAIN (U7.41), CUVET_DECTECT (R37.2 U6.C)
DIO: MAIN (U7.46), COMUNICATE_CON (J2.3)
HIN1: MAIN (U7.3), HBRIDGE1 (R3A.1)
HIN2: MAIN (U7.8), HBRIDGE2 (R3B.1)
HIN3: MAIN (U7.10), HBRIDGE3 (R3C.1)
HIN4: MAIN (U7.24), HBRIDGE4 (R3D.1)
HIN5: MAIN (U7.37), HBRIDGE5 (R3E.1)
HIN6: MAIN (U7.39), HBRIDGE6 (R3F.1)
HIN7: MAIN (U7.51), HBRIDGE7 (R3G.1)
HIN8: MAIN (U7.53), HBRIDGE8 (R3H.1)
INA_ALERT: MAIN (R7.1 U7.26), CURRENT_SENSE (R20.2 R21.1)
INA_CLK: MAIN (U7.21), CURRENT_SENSE (R18.2)
INA_CS: MAIN (U7.20), CURRENT_SENSE (R14.2)
INA_MISO: MAIN (U7.22), CURRENT_SENSE (R17.2)
INA_MOSI: MAIN (U7.23), CURRENT_SENSE (R15.2)
LIN1: MAIN (U7.2), HBRIDGE1 (R4A.1)
LIN2: MAIN (U7.4), HBRIDGE2 (R4B.1)
LIN3: MAIN (U7.9), HBRIDGE3 (R4C.1)
LIN4: MAIN (U7.11), HBRIDGE4 (R4D.1)
LIN5: MAIN (U7.25), HBRIDGE5 (R4E.1)
LIN6: MAIN (U7.38), HBRIDGE6 (R4F.1)
LIN7: MAIN (U7.40), HBRIDGE7 (R4G.1)
LIN8: MAIN (U7.52), HBRIDGE8 (R4H.1)
OUT1: MAIN (CN1.1), HBRIDGE1 (6 pins)
OUT2: MAIN (CN2.1), HBRIDGE2 (6 pins)
OUT3: MAIN (CN3.1), HBRIDGE3 (6 pins)
OUT4: MAIN (CN4.1), HBRIDGE4 (6 pins)
OUT5: MAIN (CN5.1), HBRIDGE5 (6 pins)
OUT6: MAIN (CN6.1), HBRIDGE6 (6 pins)
OUT7: MAIN (CN7.1), HBRIDGE7 (6 pins)
OUT8: MAIN (CN8.1), HBRIDGE8 (6 pins)
SRAM_CLK: MAIN (U7.34), SRAM (R27.2)
SRAM_CS: MAIN (U7.33), SRAM (R22.2)
SRAM_MISO: MAIN (U7.35), SRAM (R24.2)
SRAM_MOSI: MAIN (U7.36), SRAM (R23.2)
UART4_RX: MAIN (U7.15), COMUNICATE_CON (JP6.5)
UART4_TX: MAIN (U7.14), COMUNICATE_CON (JP6.6)
USART1_RX: MAIN (U7.43), COMUNICATE_CON (JP6.1)
USART1_TX: MAIN (U7.42), COMUNICATE_CON (JP6.10)
USART2_RX: MAIN (U7.17), COMUNICATE_CON (JP6.4)
USART2_TX: MAIN (U7.16), COMUNICATE_CON (JP6.7)
USART3_RX: MAIN (U7.30), COMUNICATE_CON (JP6.2)
USART3_TX: MAIN (U7.29), COMUNICATE_CON (JP6.9)
USB_MCU_N: MAIN (U7.44), USB_ISOLATE (U8.6)
USB_MCU_P: MAIN (U7.45), USB_ISOLATE (U8.7)
VSW_EN: MAIN (Q3.3 U7.59), VOLT_SW_300V (R35A.1), VOLT_SW_50V (R35B.1)